# Altium schematic sheet Sheet1.SchDoc
size A; SheetNumber: 1; SheetTotal: 1
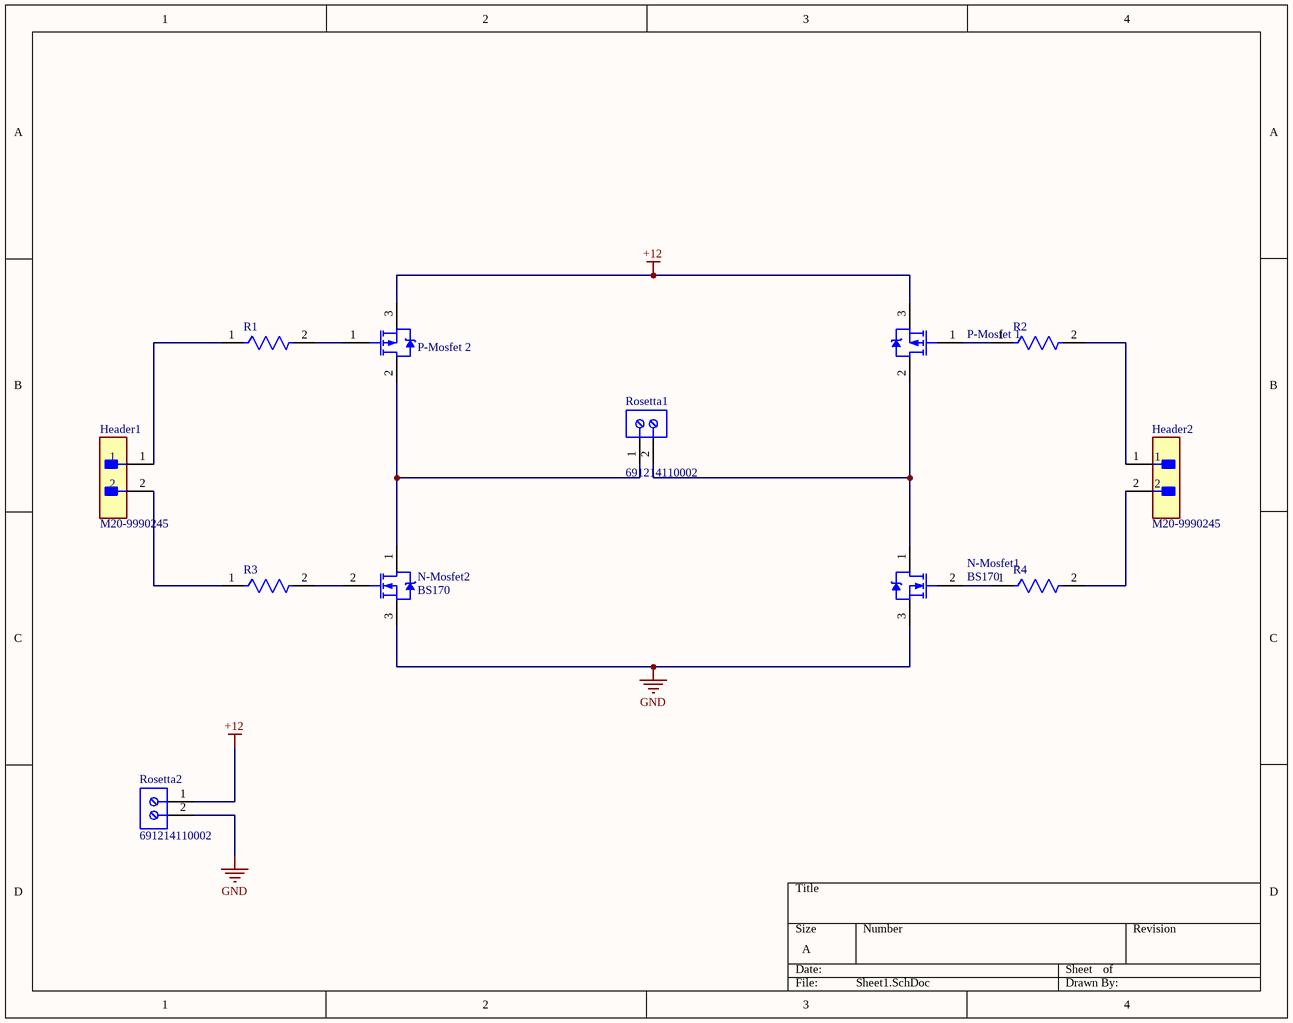
[diagram p0: Sheet1.SchDoc]

## Parts
Header1  M20-9990245  [FP-M20-9990245-MFG]
Header2  M20-9990245  [FP-M20-9990245-MFG]
N-Mosfet1  BS170  [ONSC-TO-92-3-29-11]
N-Mosfet2  BS170  [ONSC-TO-92-3-29-11]
P-Mosfet_1  NTP2955  [ONSC-TO-220-3-221A-09_AA]  (value not drawn)
P-Mosfet_2  NTP2955  [ONSC-TO-220-3-221A-09_AA]  (value not drawn)
R1  H45K0BAA  [FP-H45K0BAA-MFG]  (value not drawn)
R2  H45K0BAA  [FP-H45K0BAA-MFG]  (value not drawn)
R3  H45K0BAA  [FP-H45K0BAA-MFG]  (value not drawn)
R4  H45K0BAA  [FP-H45K0BAA-MFG]  (value not drawn)
Rosetta1  691214110002  [691214110002]
Rosetta2  691214110002  [691214110002]

## Nets
+12: P-Mosfet_1.3(S) P-Mosfet_2.3(S) Rosetta2.1
GND: N-Mosfet1.3(S) N-Mosfet2.3(S) Rosetta2.2
NetHeader1_1: Header1.1 R1.1
NetHeader1_2: Header1.2 R3.1
NetHeader2_1: Header2.1 R2.2
NetHeader2_2: Header2.2 R4.2
NetN-Mosfet1_1: N-Mosfet1.1(D) P-Mosfet_1.2(D) Rosetta1.2
NetN-Mosfet1_2: N-Mosfet1.2(G) R4.1
NetN-Mosfet2_1: N-Mosfet2.1(D) P-Mosfet_2.2(D) Rosetta1.1
NetN-Mosfet2_2: N-Mosfet2.2(G) R3.2
NetP-Mosfet_1_1: P-Mosfet_1.1(G) R2.1
NetP-Mosfet_2_1: P-Mosfet_2.1(G) R1.2

## Library data of the parts
Header1 Header2 = CMP-15831-000105-1: CONN HEADER VERT 2POS 2.54MM; Working Voltage: 750V; Gender: Male; Number of Poles: 2; Current Rating: 3A; Mated Stacking Heights: 16.54mm; Contact Resistance: 25mR; Connector Type: Male Pin; Insulation Resistance: 10GR; Mating Cycles: 300; Voltage: 50V; Flammability Rating: UL94 V-0; Pitch: 2.54mm; Series: M20; Number of Contacts: 2; Height: 0.12inch; Min Operating Temperature: -40°C; Contact Finish - Mating: GOLD; Number of Positions: 2; Number of Rows: 1; Packaging: Bulk; Package Quantity: 1000; Voltage Rating (AC): 750V; Current: 3A; Mount: Through Hole; Case/Package: SIL; Orientation: Straight; Contact Shape: Square; Weight: 0.25lb; Radiation Hardening: No; Fastening Type: Pull; Length: 5.08mm; Depth: 2.54mm; Contact Mating Length: 0.24inch; Housing Material: Nylon; Reach SVHC Compliant: Yes; Insulation Material: Nylon; Color: Black; Width: 0.25inch; Insulation Color: Black; Contact Material: Brass; Contact Type: Male Pin; Termination: Solder; Max Operating Temperature: 105°C; Contact Plating: Gold; Housing Color: Black; Max Current Rating: 3A; Lead Pitch: 2.54mm
N-Mosfet1 N-Mosfet2 = CMP-1058-00929-1: Small Signal MOSFET, 500 mA, 60 V, N-Channel, 3-Pin TO-92, Bulk Box; Manufacturer: On Semiconductor; VGS Max (V): 20; Configuration: Single; PD Max (W): 0.35; VGS(th) Max (V): 3; ID Max (A): 0.5; V(BR)DSS Min (V): 60; Channel Polarity: N Channel; PackageDescription: 3-Pin Transistor Outline, Body 4.825 x 3.685 mm, Pitch 1.27 mm; Package Type: TO-92; ComponentLink1Description: Manufacturer URL; ComponentLink1URL: http://www.onsemi.com/; DatasheetVersion: Rev. 6; ComponentLink3Description: Package Specification; PartNumber: BS170; ComponentLink2URL: http://www.onsemi.com/pub_link/Collateral/BS170-D.PDF; PackageVersion: Rev. AM; Mounting Technology: Through Hole; PackageReference: TO-92-3-29-11_AM_SL; ComponentLink2Description: Datasheet; ComponentLink3URL: http://www.onsemi.cn/pub_link/Collateral/2N6426-D.PDF; Packing: Bulk Box
P-Mosfet_1 P-Mosfet_2 = CMP-1058-00865-1: Power MOSFET, -60 V, -12 A, Single P-Channel, 3-Pin TO-220, Tube; Manufacturer: On Semiconductor; V(BR)DSS Min (V): 60; Channel Polarity: P Channel; VGS Max (V): 20; Ciss Typ (pF): 507; Crss Typ (pF): 48; VGS(th) Max (V): 4; Qrr Typ (nC): 126; Coss Typ (pF): 150; ID Max (A): 12; PackageDescription: 3-Pin Flange Mount, Vertical Straight Lead, Body 9.97 x 4.445 mm, Pitch 2.54 mm; DatasheetVersion: Rev. 2; Mounting Technology: Through Hole; ComponentLink1URL: http://www.onsemi.com/; PackageVersion: Rev. AA; PackageReference: TO-220-3-221A-09_AA; ComponentLink3URL: http://www.onsemi.com/pub_link/Collateral/MAC16C-D.PDF; ComponentLink2Description: Datasheet; ComponentLink1Description: Manufacturer URL; Configuration: Single; ComponentLink2URL: http://www.onsemi.cn/pub_link/Collateral/NTP2955-D.PDF; ComponentLink3Description: Package Specification; Packing: Tube; Package Type: TO-220-3; PartNumber: NTP2955
R1-R4 = CMP-03212-000004-1: RES 5.00K OHM 1/2W 0.1% AXIAL; Number of Resistors: 1; Power Rating: 500mW; Resistance: 5kR; Temperature Coefficient: 5ppm/°C; Voltage Rating: 350V; Lead Diameter: 0.6mm; Resistor Type: Thin Film; Mount: Axial; Contact Plating: Tin; Weight: 0.01411oz; Packaging: Bulk; Min Operating Temperature: -55°C; Package Quantity: 250; Case/Package: Axial; Number of Terminations: 2; Termination: Axial; Radiation Hardening: No; Max Operating Temperature: 155°C; RoHS Compliant: Yes; Series: Holco, Holsworthy; ELV: Compliant; Tolerance: 0.1%; Diameter: 3.7mm; Length: 10mm; Max Power Dissipation: 500mW
Rosetta1 Rosetta2 = CMP-1502-02464-2: NexarPartId: 18818288; Plating: Brass, Steel; Current: 10A; Pitch: 3.5052mm; Number of Levels: 1; Number of Contacts: 2; Wire Gauge (Min): 16AWG; Voltage: 300V; Wire Gauge (Max): 24AWG; Stripping Length: -6mm; Number of Pins: 2; Number of Rows: 1; REACH SVHC: Unknown; RoHS: Compliant; Housing Material: Nylon; Termination: Screw; Mount: Through Hole; Contact Plating: Brass, Tin; Number of Positions Per Level: 2; Color: Blue, Green; Width: 7.9mm; Voltage Rating: 300V; Length: 7.4mm; Current Rating: 10A; Wire/Cable Gauge: 24AWG; Packaging: Box; Max Operating Temperature: 105°C; Lead Pitch: 3.5mm; Height: 8.7mm; Contact Material: Brass; Min Operating Temperature: -40°C